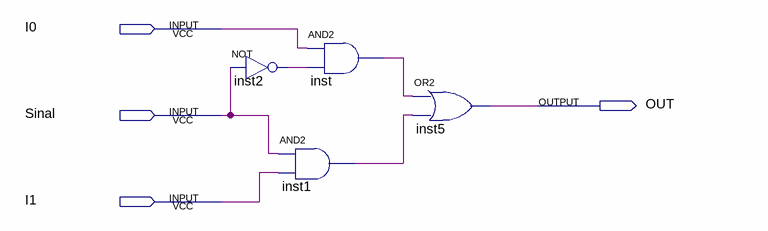
[diagram p0: schematic sheet]
// Quartus schematic blocomux.bdf as structural Verilog: 4 symbols, 4 pins
module blocomux (
  input  I0,
  input  Sinal,
  input  I1,
  output OUT
);

  wire inst1_out, inst2_out, inst_out;

  not inst2 (inst2_out, Sinal);
  and inst1 (inst1_out, Sinal, I1);
  and inst (inst_out, I0, inst2_out);
  or inst5 (OUT, inst_out, inst1_out);
endmodule
